# Altium schematic sheet P03_ Power Supplies.SchDoc
size A3; SheetNumber: 3; SheetTotal: 7
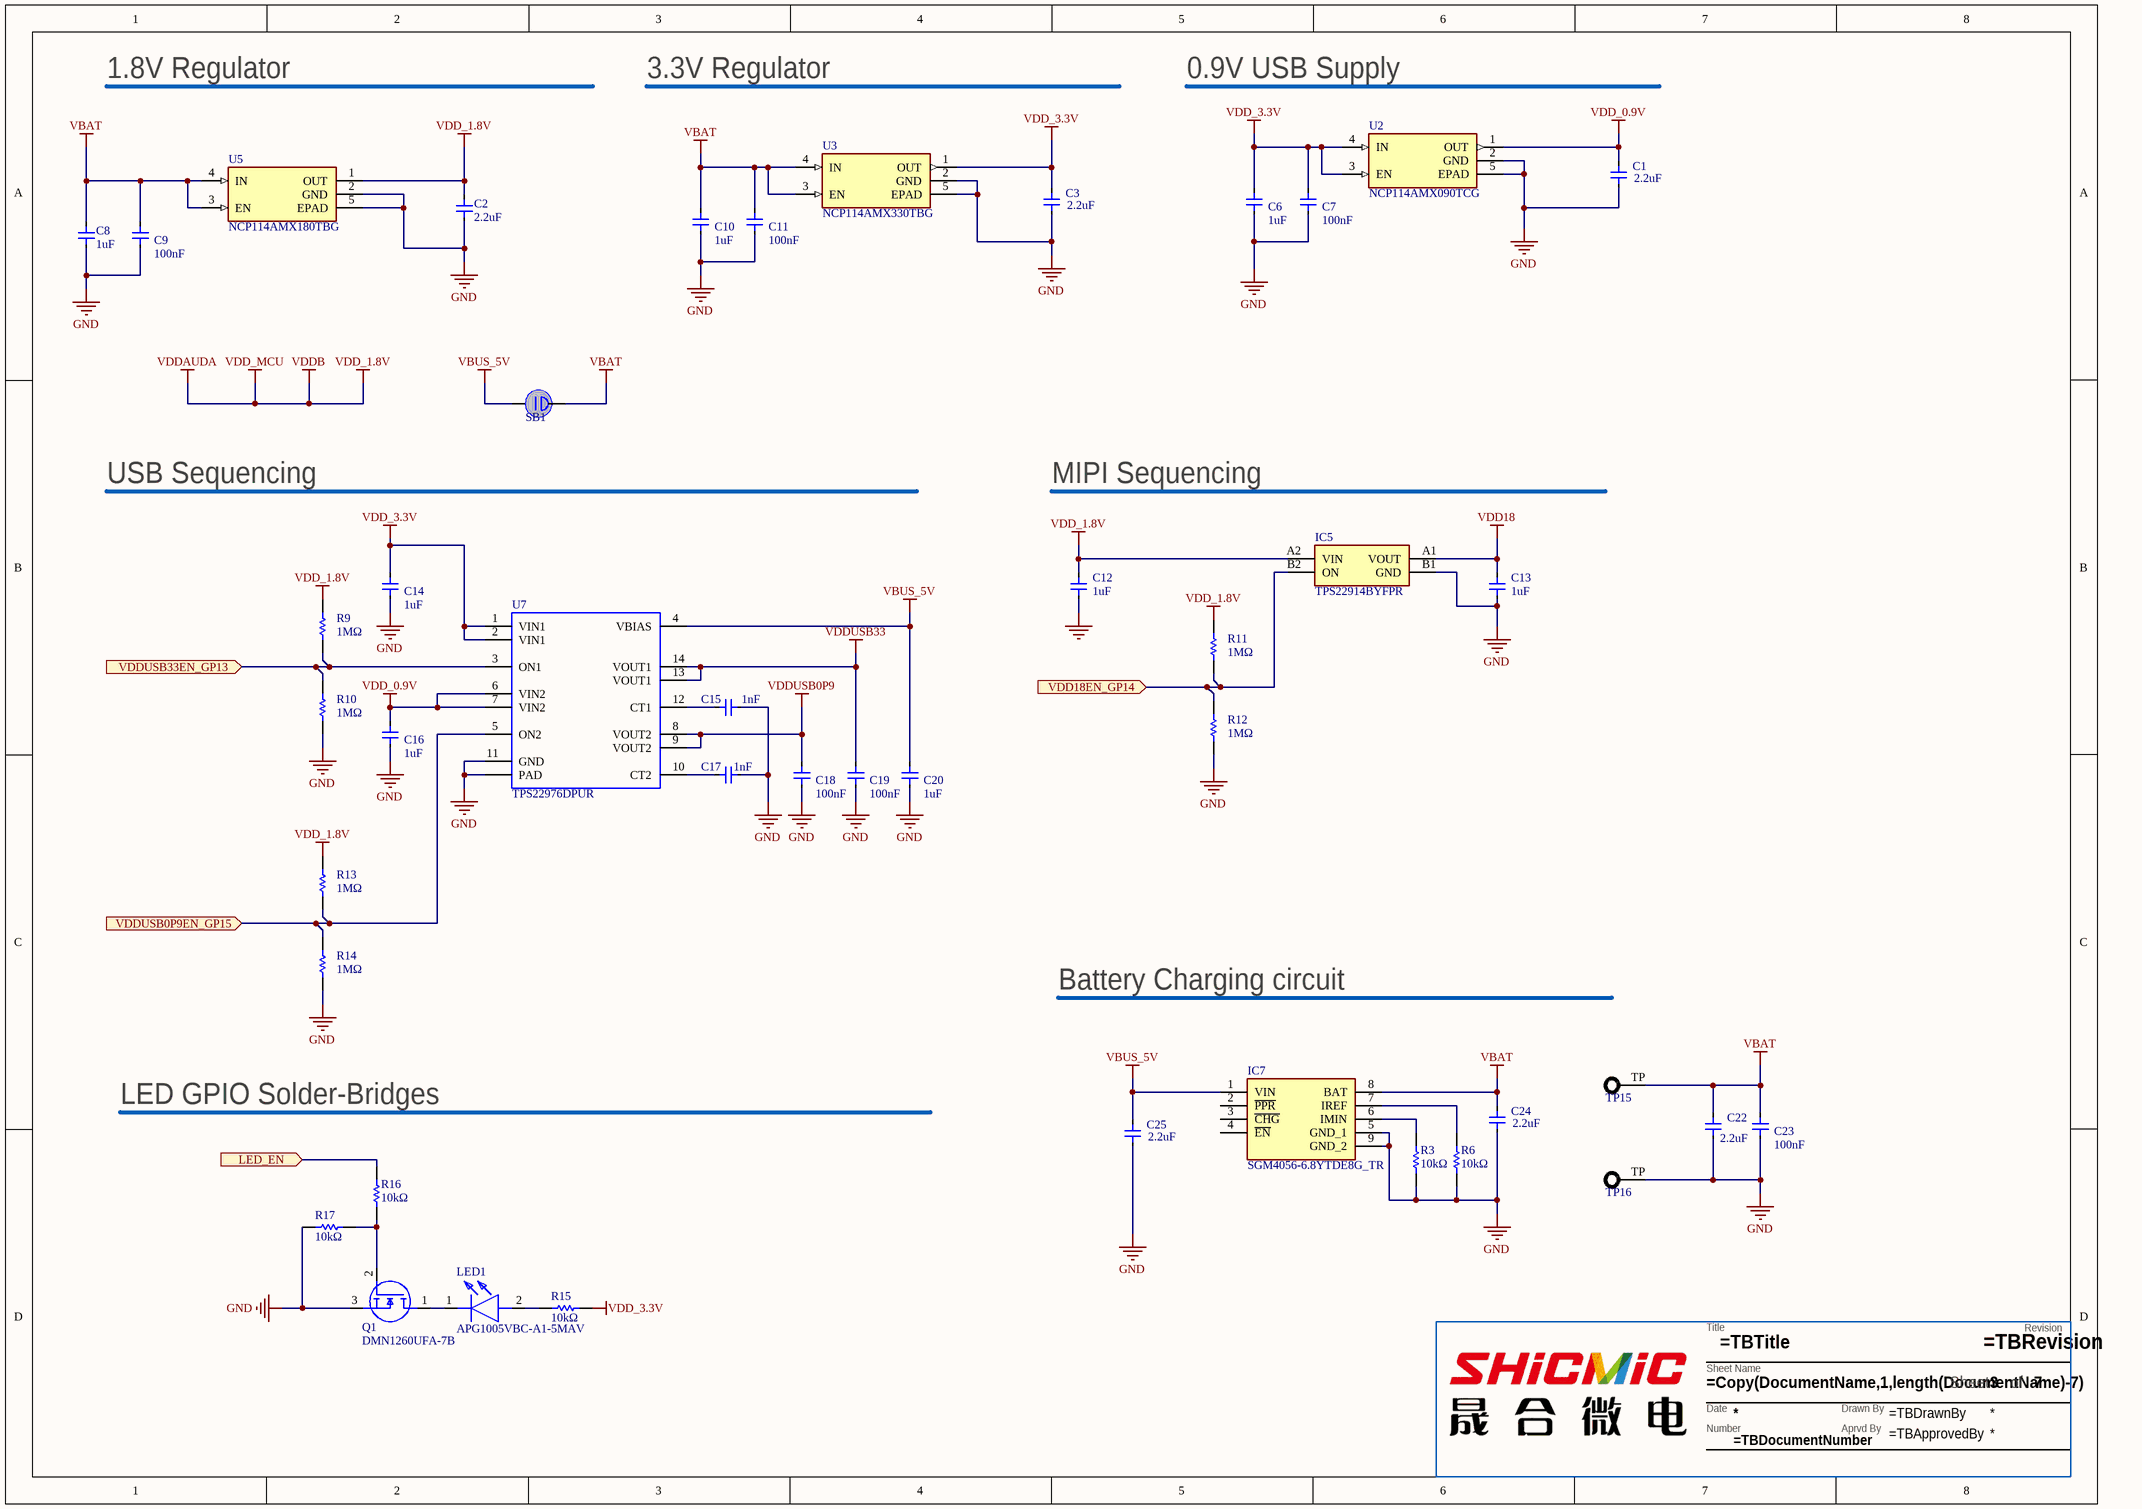
[diagram p0: P03_ Power Supplies.SchDoc]

## Parts
?  TitleBlock  (value not drawn)  (graphical)
C1  2.2uF  [CAP_0402]
C2  2.2uF  [CAP_0402]
C3  2.2uF  [CAP_0402]
C6  1uF  [CAP_0402]
C7  100nF  [CAP_0402]
C8  1uF  [CAP_0402]
C9  100nF  [CAP_0402]
C10  1uF  [CAP_0402]
C11  100nF  [CAP_0402]
C12  1uF  [CAP_0402]
C13  1uF  [CAP_0402]
C14  1uF  [CAP_0402]
C15  1nF  [CAP_0402]
C16  1uF  [CAP_0402]
C17  1nF  [CAP_0402]
C18  100nF  [CAP_0402]
C19  100nF  [CAP_0402]
C20  1uF  [CAP_0402]
C22  2.2uF  [CAP_0402]
C23  100nF  [CAP_0402]
C24  2.2uF  [CAP_0402]
C25  2.2uF  [CAP_0402]
IC5  TPS22914BYFPR  [BGA4C40P2X2_75X75X50]
IC7  SGM4056-6.8YTDE8G_TR  [TDFN-8L_L2.0-W2.0-P0.50-BL-EP]
LED1  APG1005VBC-A1-5MAV  [APG1005VBCA15MAV]
Q1  DMN1260UFA-7B  [DMN1260UFA7B]
R3  10kΩ  [RES_0402]
R6  10kΩ  [RES_0402]
R9  1MΩ  [RES_0402]
R10  1MΩ  [RES_0402]
R11  1MΩ  [RES_0402]
R12  1MΩ  [RES_0402]
R13  1MΩ  [RES_0402]
R14  1MΩ  [RES_0402]
R15  10kΩ  [RES_0402]
R16  10kΩ  [RES_0402]
R17  10kΩ  [RES_0402]
SB1  SBO  [SB39X18]  (value not drawn)  (no BOM)
TP15  PAD  [TPPAD_1.0mm]  (value not drawn)  (no BOM)
TP16  PAD  [TPPAD_1.0mm]  (value not drawn)  (no BOM)
U2  NCP114AMX090TCG  [REG_NCP114AMX330TBG]
U3  NCP114AMX330TBG  [REG_NCP114AMX330TBG]
U5  NCP114AMX180TBG  [REG_NCP114AMX330TBG]
U7  TPS22976DPUR  [R-PWSON50P300x200-N14]

## Ports
LED_EN (in), VDD18EN_GP14 (in), VDDUSB0P9EN_GP15 (in), VDDUSB33EN_GP13 (in)

## Nets
GND: C1.2 C2.2 C3.2 C6.2 C7.2 C8.2 C9.2 C10.2 C11.2 C12.2 C13.2 C14.2 C15.2 C16.2 C17.2 C18.2 C19.2 C20.2 C22.2 C23.2 C24.2 C25.2 IC5.B1(GND) IC7.5(GND_1) IC7.9(GND_2) Q1.3(S) R3.1 R6.2 R10.1 R12.1 R14.1 R17.1 TP16.TP U2.2(GND) U2.5(EPAD) U3.2(GND) U3.5(EPAD) U5.2(GND) U5.5(EPAD) U7.11(GND) U7.PAD
VBAT: C8.1 C9.1 C10.1 C11.1 C22.1 C23.1 C24.1 IC7.8(BAT) SB1.2 TP15.TP U3.3(EN) U3.4(IN) U5.3(EN) U5.4(IN)
VBUS_5V: C20.1 C25.1 IC7.1(VIN) SB1.1 U7.4(VBIAS)
VDD18: C13.1 IC5.A1(VOUT)
VDD_0.9V: C1.1 C16.1 U2.1(OUT) U7.6(VIN2) U7.7(VIN2)
VDD_1.8V: C2.1 C12.1 IC5.A2(VIN) R9.2 R11.2 R13.2 U5.1(OUT)  [also labelled VDD_MCU, VDDAUDA, VDDB]
VDD_3.3V: C3.1 C6.1 C7.1 C14.1 R15.2 U2.3(EN) U2.4(IN) U3.1(OUT) U7.1(VIN1) U7.2(VIN1)
VDDUSB0P9: C18.1 U7.8(VOUT2) U7.9(VOUT2)
VDDUSB33: C19.1 U7.13(VOUT1) U7.14(VOUT1)
LED_EN: R16.2 ; port LED_EN
VDD18EN_GP14: IC5.B2(ON) R11.1 R12.2 ; port VDD18EN_GP14
VDDUSB0P9EN_GP15: R13.1 R14.2 U7.5(ON2) ; port VDDUSB0P9EN_GP15
VDDUSB33EN_GP13: R9.1 R10.2 U7.3(ON1) ; port VDDUSB33EN_GP13
NetC15_1: C15.1 U7.12(CT1)
NetC17_1: C17.1 U7.10(CT2)
NetIC7_6: IC7.6(IMIN) R3.2
NetIC7_7: IC7.7(IREF) R6.1
NetLED1_1: LED1.1(K) Q1.1(D)
NetLED1_2: LED1.2(A) R15.1
NetQ1_2: Q1.2(G) R16.1 R17.2

Not connected (* = marked no-connect by the designer): IC7 2(~{PPR}) 3(~{CHG}) 4(~{EN})

## Notes on the sheet
- 1.8V Regulator
- 3.3V Regulator
- 0.9V USB Supply
- USB Sequencing
- MIPI Sequencing
- Battery Charging circuit
- LED GPIO Solder-Bridges
- (in symbol TitleBlock) Revision; Title; Sheet Name; Sheet; of; Date; Drawn By; Number; Aprvd By

## Library data of the parts
? = TitleBlock: Title block for Ambiq Schematics. Please have the following parameters entered in Project>Project Options>Parameters: / TBTitle / TBDocumentNumber / TBRevision / TBDrawnBy / TBApprovedBy; AMBIQ PN: TitleBlock
C1 C3 C22 C24 C25 = Capacitor: NONE; Manufacturer: Samsung; AMBIQ PN: CL05A225KP5NNNC; Tolerance: 10%; Voltage Rating: 10V; Supplier 1: Arrow Electronics; Supplier Part Number 1: CL05A225KP5NNNC; Manufacturer Part Number: CL05A225KP5NNNC; RoHS: Yes; Category: Ceramic Capacitors; Stock 1: 32414; Pricing 1: 1=0.14620, 10=0.09980, 25=0.09880, 100=0.05200, 250=0.05150, 500=0.03630, 1000=0.02990, 3000=0.02760, 6000=0.02610, 15000=0.023; Mount: Surface Mount; Case/Package: 0402; Case Code (Metric): 1005; Case Code (Imperial): 0402; Min Operating Temperature: -55°C; Max Operating Temperature: 85°C; Capacitance: 2.2uF; Packaging: Tape and Reel; Voltage Rating (DC): 10V; Series: CL; Length: 0.039inch; Width: 0.02inch; Thickness: 0.022inch; RoHS Compliant: Yes; ComponentLink1URL: https://datasheet.ciiva.com/25727/cl05a225kp5nnnc-25727777.pdf?src-supplier=Digi-Key; ComponentLink1Description: https://datasheet.ciiva.com/25727/cl05a225kp5nnnc-25727777.pdf?src-supplier=Digi-Key; Package Quantity: 1
C2 = CL05A225KP5NNNC: NONE; Manufacturer: Samsung; Tolerance: 10%; Voltage Rating: 10V; AMBIQ PN: CL05A225KP5NNNC; Supplier 1: Arrow Electronics; Supplier Part Number 1: CL05A225KP5NNNC; Manufacturer Part Number: CL05A225KP5NNNC; RoHS: Yes; Category: Ceramic Capacitors; Stock 1: 32414; Pricing 1: 1=0.14620, 10=0.09980, 25=0.09880, 100=0.05200, 250=0.05150, 500=0.03630, 1000=0.02990, 3000=0.02760, 6000=0.02610, 15000=0.023; Mount: Surface Mount; Case/Package: 0402; Case Code (Metric): 1005; Case Code (Imperial): 0402; Min Operating Temperature: -55°C; Max Operating Temperature: 85°C; Capacitance: 2.2uF; Packaging: Tape and Reel; Voltage Rating (DC): 10V; Series: CL; Length: 0.039inch; Width: 0.02inch; Thickness: 0.022inch; RoHS Compliant: Yes; ComponentLink1URL: https://datasheet.ciiva.com/25727/cl05a225kp5nnnc-25727777.pdf?src-supplier=Digi-Key; ComponentLink1Description: https://datasheet.ciiva.com/25727/cl05a225kp5nnnc-25727777.pdf?src-supplier=Digi-Key; Package Quantity: 1
C6 C10 C14 C16 C20 = Capacitor: NONE; Manufacturer: Samsung; Manufacturer Part Number: CL05A105MP5NNNC; AMBIQ PN: CL05A105KP5NNNC; Tolerance: 20%; Voltage Rating: 10V; Dielectric: X5R; Supplier 1: Newark; Supplier Part Number 1: 82AC9184; RoHS: Yes; Category: Ceramic Capacitors; Mount: Surface Mount; Case/Package: 0402; Case Code (Metric): 1005; Case Code (Imperial): 0402; Min Operating Temperature: -55°C; Max Operating Temperature: 85°C; Capacitance: 1uF; Packaging: Tape and Reel; Voltage Rating (DC): 10V; Series: CL; Construction: Flat; Length: 1mm; Width: 0.02inch; Height: 0.5mm; Thickness: 0.022inch; Depth: 0.5mm; Radiation Hardening: No; Lead Free: Lead Free; RoHS Compliant: Yes; ComponentLink1URL: https://datasheet.ciiva.com/25802/cl05a105mp5nnnc-25802049.pdf?src-supplier=Digi-Key; ComponentLink1Description: https://datasheet.ciiva.com/25802/cl05a105mp5nnnc-25802049.pdf?src-supplier=Digi-Key; Package Quantity: 1
C7 C9 C11 C18 C19 C23 = Capacitor: NONE; Manufacturer: Kyocera AVX; AMBIQ PN: 0201ZD104KAT2A; Tolerance: 10%; Voltage Rating: 10V; Supplier 1: Arrow Electronics; Supplier Part Number 1: 0201ZD104KAT2A; Manufacturer Part Number: 0201ZD104KAT2A; RoHS: Yes; Category: Ceramic Capacitors; Stock 1: 105000; Pricing 1: 15000=0.00770, 30000=0.00750, 45000=0.00740, 60000=0.00720, 75000=0.00690, 150000=0.00620 (USD); Mount: Surface Mount; Case/Package: 0201; Case Code (Metric): 0603; Case Code (Imperial): 0201; Min Operating Temperature: -55°C; Max Operating Temperature: 85°C; Capacitance: 100nF; Packaging: Tape and Reel; Voltage Rating (DC): 10V; Series: -; Lead Free: Lead Free; RoHS Compliant: Yes; ComponentLink1URL: http://www.mouser.com/ds/2/40/cx5r-776519.pdf?src-supplier=Mouser; ComponentLink1Description: http://www.mouser.com/ds/2/40/cx5r-776519.pdf?src-supplier=Mouser
C8 = CL05A105KP5NNNC: NONE; Manufacturer: Samsung; Manufacturer Part Number: CL05A105MP5NNNC; Tolerance: 20%; Voltage Rating: 10V; Dielectric: X5R; AMBIQ PN: CL05A105KP5NNNC; Supplier 1: Newark; Supplier Part Number 1: 82AC9184; RoHS: Yes; Category: Ceramic Capacitors; Mount: Surface Mount; Case/Package: 0402; Case Code (Metric): 1005; Case Code (Imperial): 0402; Min Operating Temperature: -55°C; Max Operating Temperature: 85°C; Capacitance: 1uF; Packaging: Tape and Reel; Voltage Rating (DC): 10V; Series: CL; Construction: Flat; Length: 1mm; Width: 0.02inch; Height: 0.5mm; Thickness: 0.022inch; Depth: 0.5mm; Radiation Hardening: No; Lead Free: Lead Free; RoHS Compliant: Yes; ComponentLink1URL: https://datasheet.ciiva.com/25802/cl05a105mp5nnnc-25802049.pdf?src-supplier=Digi-Key; ComponentLink1Description: https://datasheet.ciiva.com/25802/cl05a105mp5nnnc-25802049.pdf?src-supplier=Digi-Key; Package Quantity: 1
C12 C13 = Capacitor: NONE; Manufacturer: Murata; AMBIQ PN: GRM033R61A105ME15D; Tolerance: 20%; Voltage Rating: 10V; Dielectric: X5R; Supplier 1: Arrow Electronics; Supplier Part Number 1: GRM033R61A105ME15D; Manufacturer Part Number: GRM033R61A105ME15D; RoHS: Yes; Category: Ceramic Capacitors; Stock 1: 387591; Pricing 1: 1=0.35440, 10=0.26860, 25=0.26600, 50=0.24050, 100=0.18220, 250=0.18020, 500=0.17800, 1000=0.12040, 3000=0.11920, 6000=0.08160,; Mount: Surface Mount; Case/Package: 0201; Case Code (Metric): 0603; Case Code (Imperial): 0201; Min Operating Temperature: -55°C; Max Operating Temperature: 85°C; Capacitance: 1uF; Packaging: Tape and Reel; Voltage Rating (DC): 10V; Length: 0.024inch; Width: 0.012inch; Thickness: 0.015inch; RoHS Compliant: Yes; ComponentLink1URL: http://search.murata.co.jp/Ceramy/image/img/A01X/G101/ENG/GRM033R61A105ME15-01.pdf?src-supplier=Digi-Key; ComponentLink1Description: http://search.murata.co.jp/Ceramy/image/img/A01X/G101/ENG/GRM033R61A105ME15-01.pdf?src-supplier=Digi-Key
C15 C17 = Capacitor: NONE; Manufacturer: Murata; AMBIQ PN: GRM1555C1H102JA01D; Tolerance: 5%; Voltage Rating: 50V; Dielectric: C0G; Dielectric Material: Ceramic; Insulation Resistance: 10GR; Temperature Coefficient: 30ppm/°C; Supplier 1: Arrow Electronics; Supplier Part Number 1: GRM1555C1H102JA01D; Manufacturer Part Number: GRM1555C1H102JA01D; RoHS: Yes; Category: Ceramic Capacitors; Stock 1: 3380000; Pricing 1: 10000=0.00710, 20000=0.00680, 30000=0.00660, 50000=0.00590, 100000=0.00470 (USD); Mount: Surface Mount; Case/Package: 0402; Case Code (Metric): 1005; Case Code (Imperial): 0402; Min Operating Temperature: -55°C; Max Operating Temperature: 125°C; Capacitance: 1nF; Packaging: Tape and Reel; Voltage: 50V; Voltage Rating (DC): 50V; Series: GRM; Construction: Flat; Length: 1mm; Width: 0.5mm; Height: 0.5mm; Thickness: 0.022inch; Depth: 0.5mm; Radiation Hardening: No; REACH SVHC: No SVHC; Lead Free: Lead Free; RoHS Compliant: Yes; ComponentLink1URL: https://datasheet.ciiva.com/34302/1855908-34302849.pdf?src-supplier=Jameco; ComponentLink1Description: https://datasheet.ciiva.com/34302/1855908-34302849.pdf?src-supplier=Jameco; Package Quantity: 1; Termination: SMD/SMT; Number of Pins: 2; Material: Ceramic; Size: 0.5mm
IC5 = TPS22914BYFPR: Integrated Circuit; Manufacturer_Name: Texas Instruments; Datasheet Link: http://www.ti.com/lit/gpn/tps22914; Height: 0.5mm; Manufacturer_Part_Number: TPS22914BYFPR; Mouser Part Number: 595-TPS22914BYFPR; Mouser Price/Stock: https://www.mouser.co.uk/ProductDetail/Texas-Instruments/TPS22914BYFPR?qs=1MXlzafEN3%2Fs%2F8ixf9s9cA%3D%3D; Arrow Part Number: TPS22914BYFPR; Arrow Price/Stock: https://www.arrow.com/en/products/tps22914byfpr/texas-instruments?region=nac
IC7 = SGM4056-6.8YTDE8G_TR: Integrated Circuit; Manufacturer_Name: SGMICRO; Manufacturer_Part_Number: SGM4056-10.5YTDE8G/TR; Datasheet Link: https://4donline.ihs.com/images/VipMasterIC/IC/SGML/SGML-S-A0002247971/SGML-S-A0002247971-1.pdf?hkey=EF798316E3902B6ED9A73243A3159BB0; Height: 0.8mm
LED1 = APG1005VBC-A1-5MAV: LED; Manufacturer_Name: Kingbright; Datasheet Link: https://www.kingbrightusa.com/images/catalog/SPEC/APG1005VBC-A1-5MAV.pdf; Height: 0.25mm; Manufacturer_Part_Number: APG1005VBC-A1-5MAV; Mouser Part Number: 604-APG1005VBCA15MAV; Mouser Price/Stock: https://www.mouser.co.uk/ProductDetail/Kingbright/APG1005VBC-A1-5MAV?qs=Wj%2FVkw3K%252BMBzMdKeIeaEww%3D%3D
Q1 = DMN1260UFA-7B: MOSFET (N-Channel); Manufacturer_Name: Diodes Incorporated; Datasheet Link: https://www.diodes.com/assets/Datasheets/DMN1260UFA.pdf; Height: 0.4mm; Manufacturer_Part_Number: DMN1260UFA-7B; Mouser Part Number: 621-DMN1260UFA-7B; Mouser Price/Stock: https://www.mouser.co.uk/ProductDetail/Diodes-Incorporated/DMN1260UFA-7B?qs=TL2rE588Q1GjQdkyrZCA4w%3D%3D; Arrow Part Number: DMN1260UFA-7B; Arrow Price/Stock: https://www.arrow.com/en/products/dmn1260ufa-7b/diodes-incorporated
R3 R6 R15-R17 = Resistor: Surface Mount Thick Film Resistor, Rc Series, 10 Kohm, 62.5 Mw, - 1%, 50 V, 0402 [1005 Metric]; Manufacturer: Yageo; AMBIQ PN: RC0402FR-0710KL; Resistance: 10kR; Power Rating: 62.5mW; Voltage Rating: 50V; Max Power Dissipation: 63mW; Temperature Coefficient: 100ppm/°C; Supplier 1: Arrow Electronics; Supplier Part Number 1: RC0402FR-0710KL; Manufacturer Part Number: RC0402FR-0710KL; RoHS: Yes; Category: Chip SMD Resistors; Stock 1: 7776428; Pricing 1: 10000=0.00210 (USD); Case/Package: 0402; Case Code (Metric): 1005; Case Code (Imperial): 0402; Min Operating Temperature: -55°C; Max Operating Temperature: 155°C; Packaging: Tape and Reel; Resistor Type: Thick Film; Number of Terminations: 2; Termination: SMD/SMT; Voltage Rating (DC): 50V; Features: Moisture Resistant; Series: RC; Construction: Rectangular; Length: 1mm; Width: 0.5mm; Height: 0.32mm; Depth: 0.5mm; REACH SVHC: No SVHC; Military Standard: Not; Lead Free: Lead Free; RoHS Compliant: Yes; ComponentLink1URL: https://datasheet.ciiva.com/7660/38568-7660787.pdf?src-supplier=Element14; ComponentLink1Description: https://datasheet.ciiva.com/7660/38568-7660787.pdf?src-supplier=Element14; ComponentLink2URL: https://datasheet.ciiva.com/7849/1686128-7849814.pdf?src-supplier=Element14; ComponentLink2Description: https://datasheet.ciiva.com/7849/1686128-7849814.pdf?src-supplier=Element14; ComponentLink3URL: https://datasheet.ciiva.com/7983/1018594-7983486.pdf?src-supplier=Element14; Tolerance: 1%; Number of Pins: 2; Resistance Tolerance: 1%; Working Voltage: 50V; Lead Pitch: 0.2mm
R9-R14 = Resistor: RES SMD 1M OHM 1% 1/10W 0402; Manufacturer: Panasonic; AMBIQ PN: ERJ-2RKF1004X; Resistance: 1MR; Power Rating: 100mW; Voltage Rating: 50V; Temperature Coefficient: 100ppm/°C; Supplier 1: Arrow Electronics; Supplier Part Number 1: ERJ-2RKF1004X; Manufacturer Part Number: ERJ-2RKF1004X; RoHS: Yes; Category: Chip SMD Resistors; Stock 1: 330000; Pricing 1: 10000=0.00500, 30000=0.00450, 50000=0.00440, 100000=0.00400 (USD); Mount: Surface Mount; Case/Package: 0402; Weight: 2.8E-05oz; Case Code (Metric): 1005; Case Code (Imperial): 0402; Contact Plating: Tin; Min Operating Temperature: -55°C; Max Operating Temperature: 155°C; Package Quantity: 1; Packaging: Tape and Reel; Resistor Type: Thick Film; Number of Terminations: 2; Termination: SMD/SMT; Max Power Dissipation: 100mW; Voltage Rating (DC): 50V; Features: Automotive AEC-Q200; Series: ERJ; Technology: THICK FILM; Construction: Rectangular; Length: 1mm; Width: 0.02inch; Height: 0.35mm; Depth: 0.5mm; Radiation Hardening: No; REACH SVHC: Yes; Military Standard: Not; Lead Free: Lead Free; RoHS Compliant: Yes; ComponentLink1URL: https://datasheet.ciiva.com/34303/1987046-34303551.pdf; ComponentLink1Description: https://datasheet.ciiva.com/34303/1987046-34303551.pdf; ComponentLink2URL: https://datasheet.ciiva.com/11821/0900766b80f80784-11821229.pdf; ComponentLink2Description: https://datasheet.ciiva.com/11821/0900766b80f80784-11821229.pdf; ComponentLink3URL: https://datasheet.ciiva.com/7909/aoa0000ce2-7909180.pdf; Tolerance: 1%; Number of Pins: 2; Resistance Tolerance: 1%; Working Voltage: 50V
SB1 = SBO: None; AMBIQ PN: SBO
TP15 TP16 = TP_PAD: None; AMBIQ PN: TP_PAD
U2 = NCP114AMX090TCG: Linear Voltage Regulator IC Positive Fixed 1 Output 300mA 4-UDFN _1.0x1.0_; MP: NCP114AMX330TBG; MF: ON Semiconductor; Availability: Unavailable; Package: UDFN-4 ON Semiconductor; Value: *; Price: None; SnapEDA_Link: https://www.snapeda.com/parts/NCP114AMX330TBG/ON%20Semiconductor/view-part/711351/?ref=snap
U3 U5 = NCP114AMX330TBG: Linear Voltage Regulator IC Positive Fixed 1 Output 300mA 4-UDFN _1.0x1.0_; MF: ON Semiconductor; MP: NCP114AMX330TBG; Availability: Unavailable; Package: UDFN-4 ON Semiconductor; Value: *; Price: None; SnapEDA_Link: https://www.snapeda.com/parts/NCP114AMX330TBG/ON%20Semiconductor/view-part/711351/?ref=snap
U7 = TPS22976: None; Manufacturer: Texas Instruments; AMBIQ PN: TPS22976DPUT; Max Supply Voltage: 6V; Min Supply Voltage: 2.3V; Interface: On/Off; Output Type: Adjustable; Number of Outputs: 2; Max Output Current: 6A; Fault Protection: Over Temperature; Output Configuration: High Side; Output Current: 1A; Output Voltage: 5V; Quiescent Current: 220uA; Polarity: Positive; Accuracy: 0.5%; Dropout Voltage: 250mV; Input Bias Current: 120uA; Min Output Voltage: 800mV; Reference Voltage: 410mV; Manufacturer Part Number: TPS22976DPUT; Supplier 1: Arrow Electronics; Supplier Part Number 1: TPS22976DPUT; RoHS: Yes; Category: Power Management ICs; Stock 1: 250; Pricing 1: 1=0.70530, 10=0.67280, 25=0.64030, 100=0.60770, 250=0.57510 (USD); Number of Pins: 14; Min Operating Temperature: -40°C; Max Operating Temperature: 105°C; Package Quantity: 4000; Packaging: Tape and Reel; REACH SVHC: No SVHC; Lead Free: Lead Free; RoHS Compliant: Yes; ComponentLink1URL: http://www.ti.com/general/docs/suppproductinfo.tsp?distId=10&amp;gotoUrl=http%3A%2F%2Fwww.ti.com%2Flit%2Fgpn%2Ftps22976&src-sup; ComponentLink1Description: http://www.ti.com/general/docs/suppproductinfo.tsp?distId=10&amp;gotoUrl=http%3A%2F%2Fwww.ti.com%2Flit%2Fgpn%2Ftps22976&src-sup; ComponentLink2URL: https://datasheet.ciiva.com/41458/001085984-da-01-en-ic-reg-ld-mcp1826t-adje-dc-sot-223-5-mcp-41458757.pdf?src-supplier=Conrad; ComponentLink2Description: https://datasheet.ciiva.com/41458/001085984-da-01-en-ic-reg-ld-mcp1826t-adje-dc-sot-223-5-mcp-41458757.pdf?src-supplier=Conrad; Length: 0.257inch; Width: 0.14inch; Height: 0.065inch; Radiation Hardening: No; Number of Channels: 2; Max Input Voltage: 6V; Min Input Voltage: 2.3V; Output Voltage Accuracy: 0.5%; Max Output Voltage: 5V; Termination: SMD/SMT; Halogen Free: Halogen Free